# EAGLE schematic sensor_board (EAGLE 6.5.0)
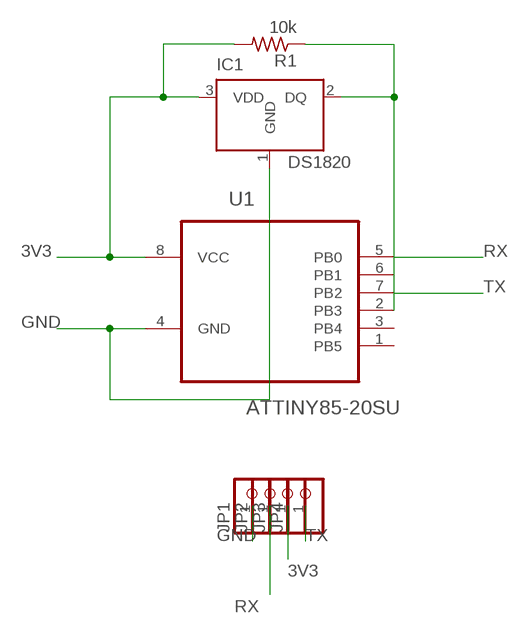
[diagram p0: schematic, sheet 1]

## Parts
IC1  DS1820  [TO-92]
JP1  PINHD-1X1  [1X01]
JP2  PINHD-1X1  [1X01]
JP3  PINHD-1X1  [1X01]
JP4  PINHD-1X1  [1X01]
R1  10k  RES-US1206  [R1206]
U1  ATTINY85-20SU  [SOIC127P798X216-8N]

## Nets
3V3: IC1.3(VDD) JP3.1 R1.2 U1.8(VCC)
GND: IC1.1(GND) JP1.1 U1.4(GND)
N$2: IC1.2(DQ) R1.1 U1.2(PB3)
RX: JP2.1 U1.5(PB0)
TX: JP4.1 U1.7(PB2)
Unconnected: U1.1(PB5) U1.3(PB4) U1.6(PB1)

## Library data of the parts
IC1 = DS1820:DS1820: DS1820 - 1-Wire Digital Thermometer
JP1-JP4 = pinhead:PINHD-1X1: PIN HEADER
R1 = fab:RES-US: Resistor (US Symbol) Variants with postfix FAB are widened to allow the routing of internal traces
U1 = Atmel_By_element14_Batch_1:ATTINY85-20SU: 8-bit Microcontroller with In-System Programmable Flash; MPN: ATTINY85-20SU; OC_FARNELL: 1455164; OC_NEWARK: 58M3797; PACKAGE: SOIC-8; SUPPLIER: Atmel